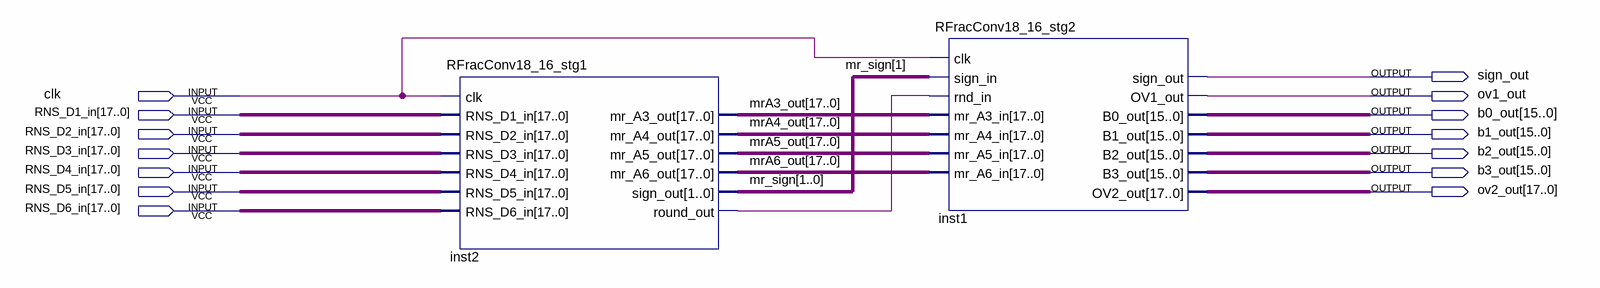
[diagram p0: schematic sheet]
// Quartus schematic RFracConv18_16.bdf as structural Verilog: 2 symbols, 14 pins
module RFracConv18_16 (
  input  clk,
  input  [17:0] RNS_D1_in,
  input  [17:0] RNS_D2_in,
  input  [17:0] RNS_D3_in,
  input  [17:0] RNS_D4_in,
  input  [17:0] RNS_D5_in,
  input  [17:0] RNS_D6_in,
  output sign_out,
  output ov1_out,
  output [15:0] b0_out,
  output [15:0] b1_out,
  output [15:0] b2_out,
  output [15:0] b3_out,
  output [17:0] ov2_out
);

  wire inst2_round_out;
  wire [1:0] mr_sign;
  wire [17:0] mrA3_out, mrA4_out, mrA5_out, mrA6_out;

  RFracConv18_16_stg1 inst2 (
    .clk(clk), .RNS_D1_in(RNS_D1_in), .RNS_D2_in(RNS_D2_in), .RNS_D3_in(RNS_D3_in), .RNS_D4_in(RNS_D4_in),
    .RNS_D5_in(RNS_D5_in), .RNS_D6_in(RNS_D6_in), .round_out(inst2_round_out), .mr_A3_out(mrA3_out),
    .mr_A4_out(mrA4_out), .mr_A5_out(mrA5_out), .mr_A6_out(mrA6_out), .sign_out(mr_sign));
  RFracConv18_16_stg2 inst1 (
    .clk(clk), .sign_in(mr_sign[1]), .rnd_in(inst2_round_out), .mr_A3_in(mrA3_out), .mr_A4_in(mrA4_out),
    .mr_A5_in(mrA5_out), .mr_A6_in(mrA6_out), .OV1_out(ov1_out), .sign_out(sign_out), .B0_out(b0_out),
    .B1_out(b1_out), .B2_out(b2_out), .B3_out(b3_out), .OV2_out(ov2_out));
endmodule
